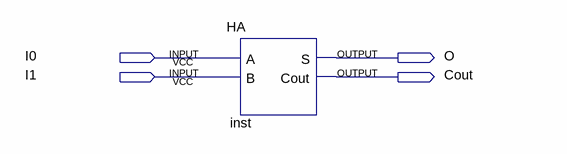
[diagram p0: schematic sheet]
// Quartus schematic A2B3.bdf as structural Verilog: 1 symbols, 4 pins
module A2B3 (
  input  I0,
  input  I1,
  output O,
  output Cout
);

  HA inst (.A(I0), .B(I1), .S(O), .Cout(Cout));
endmodule
